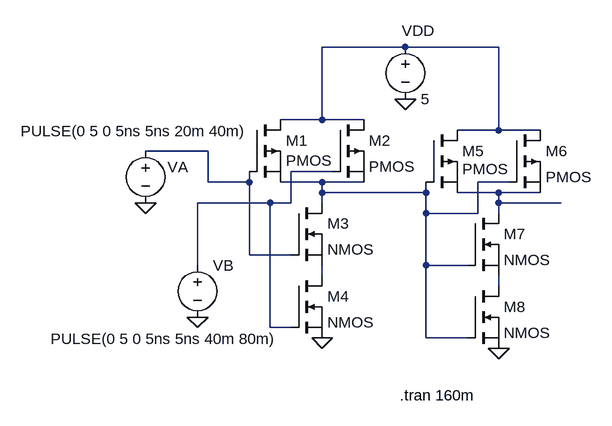
[diagram p0: schematic AND GATE.asc]
AND GATE.asc, the LTspice schematic file:
Version 4.1
SHEET 1 880 680
WIRE 352 -48 224 -48
WIRE 496 -48 352 -48
WIRE 224 64 224 -48
WIRE 224 64 160 64
WIRE 288 64 224 64
WIRE 496 80 496 -48
WIRE 496 80 432 80
WIRE 560 80 496 80
WIRE 48 112 -48 112
WIRE 240 144 176 144
WIRE 48 160 48 112
WIRE 112 160 112 144
WIRE 112 160 48 160
WIRE 224 160 160 160
WIRE 288 160 224 160
WIRE 512 160 464 160
WIRE 224 176 224 160
WIRE 384 176 384 160
WIRE 384 176 224 176
WIRE 496 176 432 176
WIRE 560 176 496 176
WIRE 144 192 32 192
WIRE 176 192 176 144
WIRE 176 192 144 192
WIRE 224 192 224 176
WIRE 496 192 496 176
WIRE 592 192 496 192
WIRE 384 208 384 176
WIRE 464 208 464 160
WIRE 464 208 384 208
WIRE 496 208 496 192
WIRE 112 272 112 160
WIRE 176 272 112 272
WIRE 32 288 32 192
WIRE 384 288 384 208
WIRE 448 288 384 288
WIRE 224 304 224 288
WIRE 496 320 496 304
WIRE 144 384 144 192
WIRE 176 384 144 384
WIRE 384 400 384 288
WIRE 448 400 384 400
FLAG 352 32 0
FLAG -48 192 0
FLAG 32 368 0
FLAG 224 400 0
FLAG 496 416 0
SYMBOL pmos 112 64 R0
WINDOW 3 56 63 Left 2
SYMATTR InstName M1
SYMBOL pmos 240 64 R0
SYMATTR InstName M2
SYMBOL nmos 176 192 R0
SYMATTR InstName M3
SYMBOL nmos 176 304 R0
SYMATTR InstName M4
SYMBOL pmos 384 80 R0
WINDOW 3 56 60 Left 2
SYMATTR InstName M5
SYMBOL pmos 512 80 R0
SYMATTR InstName M6
SYMBOL nmos 448 208 R0
SYMATTR InstName M7
SYMBOL nmos 448 320 R0
SYMATTR InstName M8
SYMBOL voltage 352 -64 R0
WINDOW 0 -5 -9 Left 2
WINDOW 123 0 0 Left 0
WINDOW 39 0 0 Left 0
SYMATTR InstName VDD
SYMATTR Value 5
SYMBOL voltage -48 96 R0
WINDOW 0 34 41 Left 2
WINDOW 3 -192 -15 Left 2
WINDOW 123 0 0 Left 0
WINDOW 39 0 0 Left 0
SYMATTR InstName VA
SYMATTR Value PULSE(0 5 0 5ns 5ns 20m 40m)
SYMBOL voltage 32 272 R0
WINDOW 3 -226 129 Left 2
WINDOW 123 0 0 Left 0
WINDOW 39 0 0 Left 0
SYMATTR InstName VB
SYMATTR Value PULSE(0 5 0 5ns 5ns 40m 80m)
TEXT 344 488 Left 2 !.tran 160m

The netlist it stands for:
* AND GATE.asc
M1 N001 N002 N004 N004 PMOS
M2 N001 N003 N004 N004 PMOS
M3 N004 N002 N006 N006 NMOS
M4 N006 N003 0 0 NMOS
M5 N001 N004 N005 N005 PMOS
M6 N001 N004 N005 N005 PMOS
M7 N005 N004 N007 N007 NMOS
M8 N007 N004 0 0 NMOS
VDD N001 0 5
VA N002 0 PULSE(0 5 0 5ns 5ns 20m 40m)
VB N003 0 PULSE(0 5 0 5ns 5ns 40m 80m)
.model NMOS NMOS
.model PMOS PMOS
.lib standard.mos
.tran 160m
.backanno
.end